# Altium schematic sheet HumFlex3_lower.SchDoc
size A4; SheetNumber: 2; SheetTotal: 3
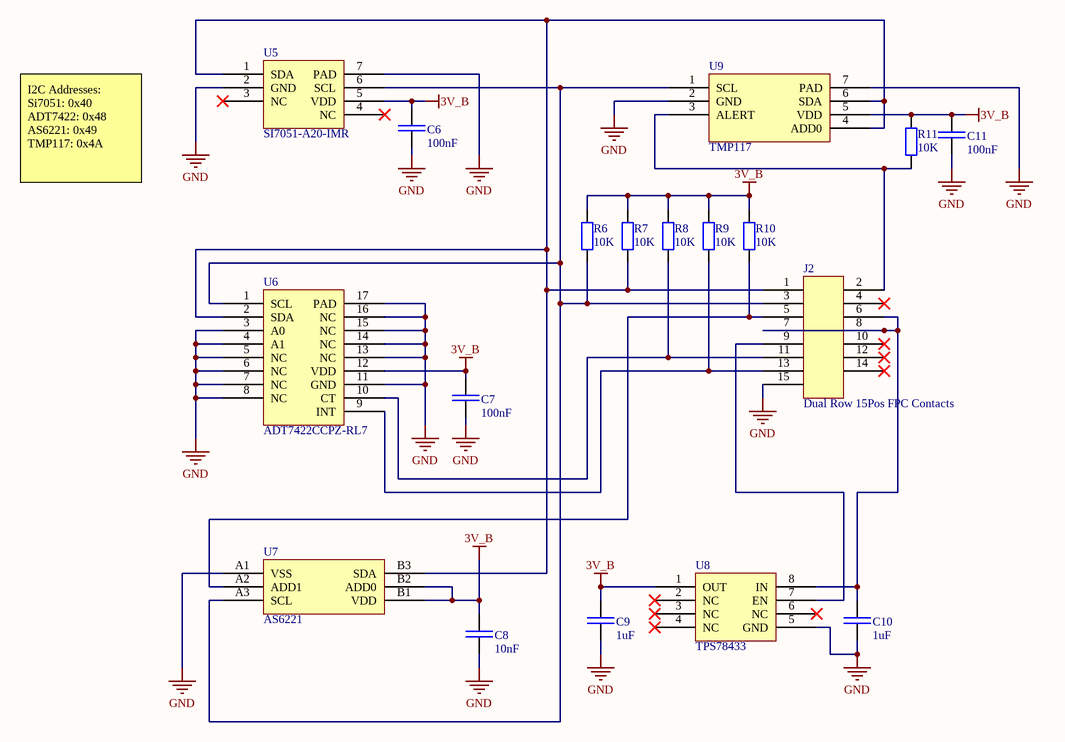
[diagram p0: HumFlex3_lower.SchDoc]

## Parts
C6  100nF  [CAP_SM0603_YAGEOCC2_N]
C7  100nF  [CAP_SM0603_YAGEOCC2_N]
C8  10nF  [CAP_SM0402_YAGEOCC2_N]
C9  1uF  [CAP_SM0805_YAGEOCC2_N]
C10  1uF  [CAP_SM0805_YAGEOCC2_N]
C11  100nF  [CAP_SM0603_YAGEOCC2_N]
J2  Dual Row 15Pos FPC Contacts  [AYF331535_FPC]
R6  10K  [RES_SM0603_YAGEORC_N]
R7  10K  [RES_SM0603_YAGEORC_N]
R8  10K  [RES_SM0603_YAGEORC_N]
R9  10K  [RES_SM0603_YAGEORC_N]
R10  10K  [RES_SM0603_YAGEORC_N]
R11  10K  [RES_SM0603_YAGEORC_N]
U5  SI7051-A20-IMR  [SI7050/1/2/3/4/5]
U6  ADT7422CCPZ-RL7  [ADT7422_QFN]
U7  AS6221  [AS6221_BGA]
U8  TPS78433  [TPS784xxxQDRBRQ1_SON]
U9  TMP117  [TMP117(N/M)AIDRV_WSON]

## Nets
3V_B: C6.2 C7.2 C8.1 C9.2 C11.2 R6.2 R7.2 R8.2 R9.2 R10.2 R11.2 U5.5(VDD) U6.12(VDD) U7.B1(VDD) U7.B2(ADD0) U8.1(OUT) U9.5(VDD)
GND: C6.1 C7.1 C8.2 C9.1 C10.1 C11.1 J2.15 U5.2(GND) U5.7(PAD) U6.3(A0) U6.4(A1) U6.5(NC) U6.6(NC) U6.7(NC) U6.8(NC) U6.11(GND) U6.13(NC) U6.14(NC) U6.15(NC) U6.16(NC) U6.17(PAD) U7.A1(VSS) U8.5(GND) U9.2(GND) U9.7(PAD)
NetC10_2: C10.2 J2.6 J2.7 J2.8 U8.8(IN)
NetJ2_1: J2.1 R7.1 U5.1(SDA) U6.2(SDA) U7.B3(SDA) U9.4(ADD0) U9.6(SDA)
NetJ2_2: J2.2 R11.1 U9.3(ALERT)
NetJ2_3: J2.3 R6.1 U5.6(SCL) U6.1(SCL) U7.A3(SCL) U9.1(SCL)
NetJ2_5: J2.5 R10.1 U7.A2(ADD1)
NetJ2_9: J2.9 U8.7(EN)
NetJ2_11: J2.11 R8.1 U6.10(CT)
NetJ2_13: J2.13 R9.1 U6.9(INT)

Not connected (* = marked no-connect by the designer): J2 4* 10* 12* 14*; U5 3(NC)* 4(NC)*; U8 2(NC)* 3(NC)* 4(NC)* 6(NC)*

## Notes on the sheet
- I2C Addresses:
  Si7051: 0x40
  ADT7422: 0x48
  AS6221: 0x49
  TMP117: 0x4A

## Library data of the parts
C6 C7 C11 = CC0603KRX7R9BB104: CAP 100nF SM0603 X7R 50V YAGEO CC2; Tolerance (%): 10; Voltage Rating (Volts): 50; Value: 100nF; Category: Capacitor; Manufacturer: Yageo; Manufacturer Part Number: CC0603KRX7R9BB104; Package: 0603; Supplier Part Number 1: 1362556; Supplier 1: Farnell; ComponentLink1URL: http://www.yageo.com; ComponentLink1Description: Manufacturer Website; Supplier 2: Mouser; Supplier Part Number 2: 603-CC603KRX7R9BB104
C8 = CC0402KRX7R9BB103: CAP 10nF SM0402 X7R 50V YAGEO CC2; Manufacturer Part Number: CC0603KRX7R9BB103; Tolerance (%): 10; Voltage Rating (Volts): 50; Category: Capacitor; Manufacturer: Yageo; Package: 0603; Value: 10nF; Supplier Part Number 1: 3369167; Supplier 1: Farnell; ComponentLink1URL: http://www.yageo.com; ComponentLink1Description: Manufacturer Website; Supplier 2: Mouser; Supplier Part Number 2: 603-CC402KRX7R9BB103; Supplier 3: Digi-Key; Supplier Part Number 3: 311-1349-1-ND
C9 C10 = CC0805KKX7R8BB105: CAP 1uF SM0805 X7R 25V YAGEO CC2; Tolerance (%): 10; Voltage Rating (Volts): 25; Value: 1uF; Category: Capacitor; Manufacturer: Yageo; Manufacturer Part Number: CC0805KKX7R8BB105; Package: 0805; Supplier Part Number 1: 1458903; Supplier 1: Farnell; ComponentLink1URL: http://www.yageo.com; ComponentLink1Description: Manufacturer Website; Supplier 2: Digi-Key; Supplier Part Number 2: 311-1456-1-ND; Supplier 3: Mouser; Supplier Part Number 3: 603-CC805KKX7R8BB105
J2 = FPC_Contacts_15_DualRow
R6-R11 = RC0603FR-0710KL: RES 10K SM0603 YAGEO RC_L; Power (Watts): 0.1; Resistance (Ohms): 10000; Tolerance (%): 1; Value: 10K; Category: Resistor; Manufacturer: Yageo; Manufacturer Part Number: RC0603FR-0710KL; Package: 0603; Supplier Part Number 1: 9238603; Supplier 1: Farnell; ComponentLink1URL: http://www.yageo.com; ComponentLink1Description: Manufacturer Website; Supplier 2: Digi-Key; Supplier Part Number 2: 311-10.0KHRCT-ND
U5 = SI7051-A20-IMR: Si7051-A20 Temperature Sensor ±0.1°C maximum accuracy, Digital I2C, -40°C ~ 125°C 14b 6-DFN (3x3); Supplier 1: Farnell; Supplier Part Number 1: 3265013RL; Supplier 2: Mouser; Supplier Part Number 2: 634-SI7051-A20-IMR; Supplier 3: Digi-Key; Supplier Part Number 3: 336-4764-1-ND
U6 = ADT7422CCPZ-RL7: ADT7422 Temperature Sensor, ±0.1°C Accuracy, 16b, Digital I2C / -40°C bis 125°C 16-LFCSP-WQ (4x4); Supplier 1: Mouser; Supplier Part Number 1: 584-ADT7422CCPZ-RL7; Supplier 2: Digi-Key; Supplier Part Number 2: 505-ADT7422CCPZ-RL7CT-ND
U7 = AS6221-AWLT-S: AS6221 Temperature Sensor Digital -40°C ~ 125°C 16b 6-WLCSP (1.5x1.03); Supplier 1: Mouser; Supplier Part Number 1: 985-AS6221-AWLT-S; Supplier 2: Digi-Key; Supplier Part Number 2: 4991-AS6221-AWLT-SCT-ND
U8 = TPS78433QWDRBRQ1: TPS78433-Q1 3.3V, 300-mA, High-PSRR Low-Dropout Voltage Regulator With High Accuracy and Enable,  8-SON (3x3); Supplier 1: Mouser; Supplier Part Number 1: 595-TPS78433QWDRBRQ1; Supplier 2: Digi-Key; Supplier Part Number 2: 296-TPS78433QWDRBRQ1CT-ND
U9 = TMP117NAIDRVR: TMP117 High-Accuracy, Low-Power, Digital Temperature Sensor, -55°C bis 150°C, 16b 6-WSON (2x2); Supplier 1: Mouser; Supplier Part Number 1: 595-TMP117NAIDRVR; Supplier 2: Digi-Key; Supplier Part Number 2: 296-51836-6-ND